# EAGLE design BSK (EAGLE 9.4.2)
ESKD_DESCRIPTION1: 207|235|224|242|224|32|193|209|202|49; ESKD_DESCRIPTION2: 241|245|229|236|224|32|253|235|229|234|242|240|232|247|229|241|234|224|255; ESKD_DESCRIPTION3: 239|240|232|237|246|232|239|232|224|235|252|237|224|255; ESKD_NUMBER: 67|67|83|49|46|50|50|48|48|45|48|221|51; ESKD_NUMBER_SHEET: 49; ESKD_SHEETS: 49
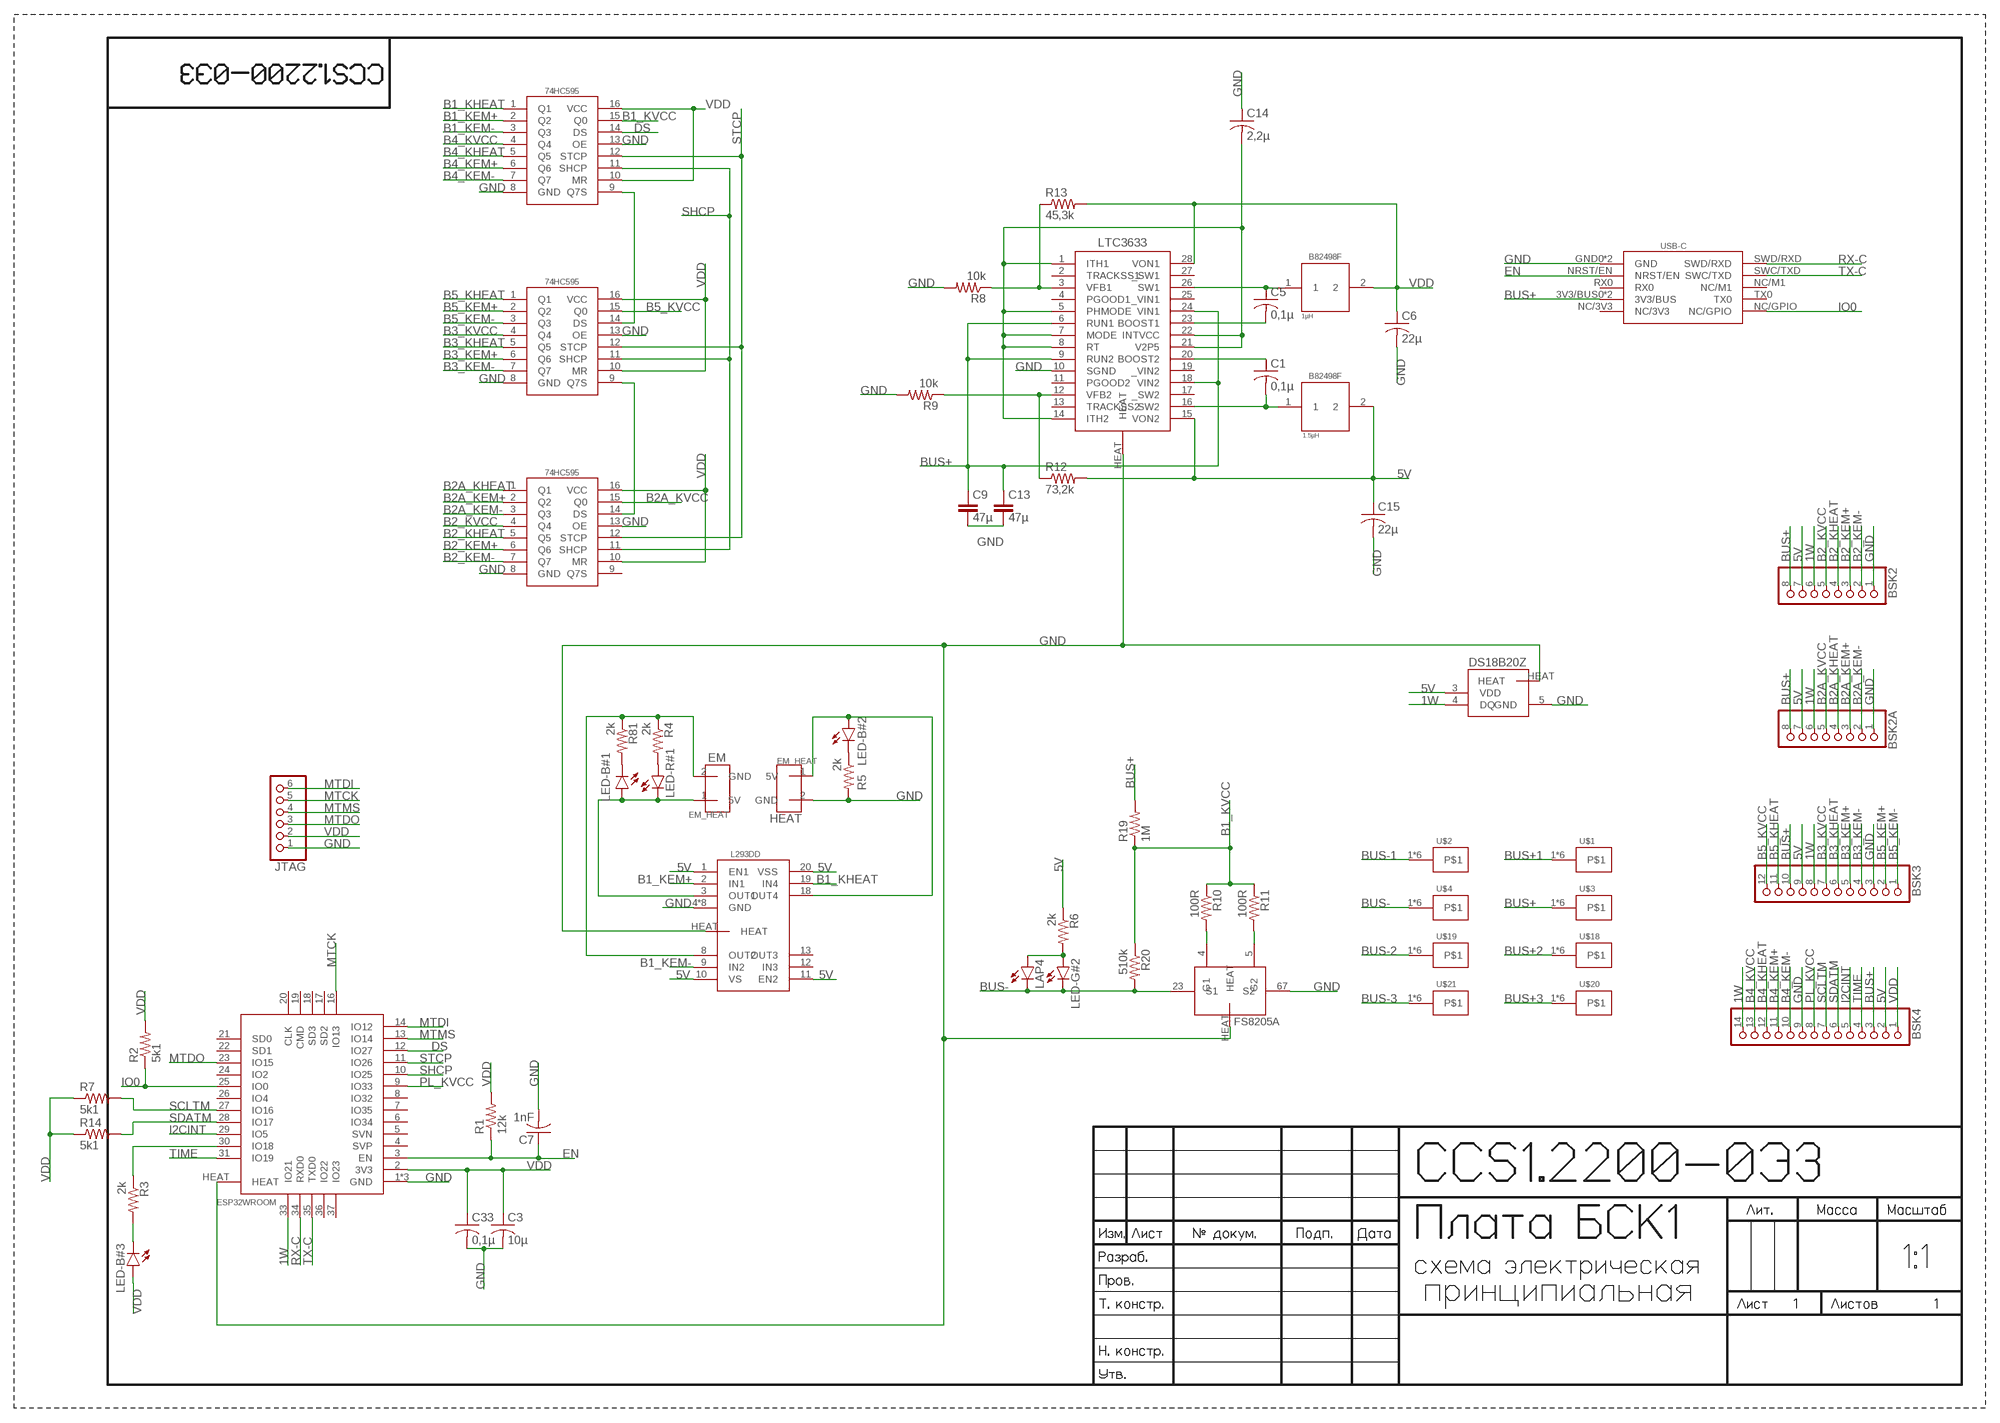
[diagram p0: schematic, sheet 1]

## Parts
74HC595#1  74HC595  [74HC595]
74HC595#2  74HC595  [74HC595]
74HC595#3  74HC595  [74HC595]
B82498F#1  1µH  B82498F  [B82498F]
B82498F#2  B82498F  [B82498F]
BSK2  PINHD-1X8  [1X08]
BSK2A  PINHD-1X8  [1X08]
BSK3  PINHD-1X12  [1X12]
BSK4  PINHD-1X14  [1X14]
C1  0,1µ  C-USC0603  [C0603]
C3  10µ  C-USC1206  [C1206]
C5  0,1µ  C-USC0603  [C0603]
C6  22µ  C-USC1206  [C1206]
C7  1nF  C-USC0603  [C0603]
C9  47µ  C-EUC1210  [C1210]
C13  47µ  C-EUC1210  [C1210]
C14  2,2µ  C-USC0603  [C0603]
C15  22µ  C-USC1206  [C1206]
C33  0,1µ  C-USC0603  [C0603]
DS18B20Z  DS18B20Z  [DS18B20Z]
EM  EM_HEAT  [EM_HEAT]
FS8205A  FS8205A+  [FS8205A+]
HEATER  EM_HEAT  [EM_HEAT]
JTAG  PINHD-1X6  [1X06]
L293DD  L293DD  [L293DD]
LAP4  LAP4-BOTTOM  [P47F-BOTTOM]
LED-B#1  LEDCHIPLED_0603  [CHIPLED_0603]
LED-B#2  LEDCHIPLED_0603  [CHIPLED_0603]
LED-B#3  LEDCHIPLED_0603  [CHIPLED_0603]
LED-G#2  LEDCHIPLED_0603  [CHIPLED_0603]
LED-R#1  LEDCHIPLED_0603  [CHIPLED_0603]
LTC3633  LTC3633  [LTC3633]
R1  12k  R-US_R0603  [R0603]
R2  5k1  R-US_R0603  [R0603]
R3  2k  R-US_R0603  [R0603]
R4  2k  R-US_R0603  [R0603]
R5  2k  R-US_R0603  [R0603]
R6  2k  R-US_R0603  [R0603]
R7  5k1  R-US_R0603  [R0603]
R8  10k  R-US_R0603  [R0603]
R9  10k  R-US_R0603  [R0603]
R10  100R  R-US_R0603  [R0603]
R11  100R  R-US_R0603  [R0603]
R12  73,2k  R-US_R0603  [R0603]
R13  45,3k  R-US_R0603  [R0603]
R14  5k1  R-US_R0603  [R0603]
R19  1M  R-US_R0603  [R0603]
R20  510k  R-US_R0603  [R0603]
R81  2k  R-US_R0603  [R0603]
U$1  KCONNECT  [KCONNECT]
U$2  KCONNECT  [KCONNECT]
U$3  KCONNECT  [KCONNECT]
U$4  KCONNECT  [KCONNECT]
U$13  ESP32WROOM  [ESP32WROOM]
U$18  KCONNECT  [KCONNECT]
U$19  KCONNECT  [KCONNECT]
U$20  KCONNECT  [KCONNECT]
U$21  KCONNECT  [KCONNECT]
USB-C  USB-C  [USB-C]

## Nets
1W: BSK2.6 BSK2A.6 BSK3.8 BSK4.14 DS18B20Z.4(DQ) U$13.33(IO21)
5V: B82498F#2.2 BSK2.7 BSK2A.7 BSK3.9 BSK4.2 C15.1 DS18B20Z.3(VDD) L293DD.1(EN1) L293DD.10(VS) L293DD.11(EN2) L293DD.20(VSS) LTC3633.15(VON2) R6.1 R12.2
B1_KEM+: 74HC595#1.2(Q2) L293DD.2(IN1)
B1_KEM-: 74HC595#1.3(Q3) L293DD.9(IN2)
B1_KHEAT: 74HC595#1.1(Q1) L293DD.19(IN4)
B1_KVCC: 74HC595#1.15(Q0) R10.1 R11.1 R19.1 R20.1
B2_KEM+: 74HC595#3.6(Q6) BSK2.3
B2_KEM-: 74HC595#3.7(Q7) BSK2.2
B2_KHEAT: 74HC595#3.5(Q5) BSK2.4
B2_KVCC: 74HC595#3.4(Q4) BSK2.5
B2A_KEM+: 74HC595#3.2(Q2) BSK2A.3
B2A_KEM-: 74HC595#3.3(Q3) BSK2A.2
B2A_KHEAT: 74HC595#3.1(Q1) BSK2A.4
B2A_KVCC: 74HC595#3.15(Q0) BSK2A.5
B3_KEM+: 74HC595#2.6(Q6) BSK3.5
B3_KEM-: 74HC595#2.7(Q7) BSK3.4
B3_KHEAT: 74HC595#2.5(Q5) BSK3.6
B3_KVCC: 74HC595#2.4(Q4) BSK3.7
B4_KEM+: 74HC595#1.6(Q6) BSK4.11
B4_KEM-: 74HC595#1.7(Q7) BSK4.10
B4_KHEAT: 74HC595#1.5(Q5) BSK4.12
B4_KVCC: 74HC595#1.4(Q4) BSK4.13
B5_KEM+: 74HC595#2.2(Q2) BSK3.2
B5_KEM-: 74HC595#2.3(Q3) BSK3.1
B5_KHEAT: 74HC595#2.1(Q1) BSK3.11
B5_KVCC: 74HC595#2.15(Q0) BSK3.12
BUS+: BSK2.8 BSK2A.8 BSK3.10 BSK4.3 C9.1 C13.1 LTC3633.6(RUN1) LTC3633.9(RUN2) LTC3633.18(VIN2) LTC3633.24(VIN1) R19.2 U$3.1 U$3.2 U$3.3 U$3.4 U$3.P$1 U$3.P$2 USB-C.3V3/BUS0(3V3/BUS) USB-C.3V3/BUS1(3V3/BUS)
BUS+1: U$1.1 U$1.2 U$1.3 U$1.4 U$1.P$1 U$1.P$2
BUS+2: U$18.1 U$18.2 U$18.3 U$18.4 U$18.P$1 U$18.P$2
BUS+3: U$20.1 U$20.2 U$20.3 U$20.4 U$20.P$1 U$20.P$2
BUS-: FS8205A.23(S1) LAP4.C LED-G#2.C R20.2 U$4.1 U$4.2 U$4.3 U$4.4 U$4.P$1 U$4.P$2
BUS-1: U$2.1 U$2.2 U$2.3 U$2.4 U$2.P$1 U$2.P$2
BUS-2: U$19.1 U$19.2 U$19.3 U$19.4 U$19.P$1 U$19.P$2
BUS-3: U$21.1 U$21.2 U$21.3 U$21.4 U$21.P$1 U$21.P$2
DS: 74HC595#1.14(DS) U$13.12(IO27)
EN: C7.1 R1.1 U$13.3(EN) USB-C.NRST/EN
GND: 74HC595#1.8(GND) 74HC595#1.13(OE) 74HC595#2.8(GND) 74HC595#2.13(OE) 74HC595#3.8(GND) 74HC595#3.13(OE) BSK2.1 BSK2A.1 BSK3.3 BSK4.9 C3.2 C6.2 C7.2 C9.2 C13.2 C14.1 C15.2 C33.2 DS18B20Z.5(GND) DS18B20Z.HEAT FS8205A.67(S2) FS8205A.HEAT HEATER.2(GND) JTAG.1 L293DD.4(GND) L293DD.5(GND) L293DD.6(GND) L293DD.7(GND) L293DD.14(GND) L293DD.15(GND) L293DD.16(GND) L293DD.17(GND) L293DD.HEAT LTC3633.10(SGND) LTC3633.HEAT R5.2 R8.2 R9.2 U$13.1(GND) U$13.15(GND) U$13.38(GND) U$13.HEAT USB-C.GND0(GND) USB-C.GND1(GND)
I2CINT: BSK4.5 U$13.29(IO5)
IO0: R2.1 U$13.25(IO0) USB-C.NC/GPIO
IO1: R3.1 U$13.30(IO18)
MTCK: JTAG.5 U$13.16(IO13)
MTDI: JTAG.6 U$13.14(IO12)
MTDO: JTAG.3 U$13.23(IO15)
MTMS: JTAG.4 U$13.13(IO14)
N$1: EM.1(5V) L293DD.3(OUT1) LED-B#1.A LED-R#1.C
N$2: EM.2(GND) L293DD.8(OUT2) R4.1 R81.1
N$3: HEATER.1(5V) L293DD.18(OUT4) LED-B#2.A
N$8: FS8205A.4(G1) R10.2
N$9: FS8205A.5(G2) R11.2
N$19: 74HC595#1.9(Q7S) 74HC595#2.14(DS)
N$20: 74HC595#2.9(Q7S) 74HC595#3.14(DS)
N$24: C14.2 LTC3633.1(ITH1) LTC3633.5(PHMODE) LTC3633.7(MODE) LTC3633.8(RT) LTC3633.14(ITH2) LTC3633.21(V2P5) LTC3633.22(INTVCC)
N$25: LTC3633.3(VFB1) R8.1 R13.1
N$28: B82498F#1.1 C5.1 LTC3633.26(SW1)
N$31: C5.2 LTC3633.23(BOOST1)
N$32: C1.1 LTC3633.20(BOOST2)
N$33: B82498F#2.1 C1.2 LTC3633.16(SW2)
N$34: LED-B#3.C R3.2
N$35: LED-B#1.C R81.2
N$36: LED-R#1.A R4.2
N$37: LED-B#2.C R5.1
N$38: LAP4.A LED-G#2.A R6.2
N$39: LTC3633.12(VFB2) R9.1 R12.1
PL_KVCC: BSK4.8 U$13.9(IO33)
RX-C: U$13.34(RXD0) USB-C.SWD/RXD
SCLTM: BSK4.7 R7.2 U$13.27(IO16)
SDATM: BSK4.6 R14.2 U$13.28(IO17)
SHCP: 74HC595#1.11(SHCP) 74HC595#2.11(SHCP) 74HC595#3.11(SHCP) U$13.10(IO25)
STCP: 74HC595#1.12(STCP) 74HC595#2.12(STCP) 74HC595#3.12(STCP) U$13.11(IO26)
TIME: BSK4.4 U$13.31(IO19)
TX-C: U$13.35(TXD0) USB-C.SWC/TXD
VDD: 74HC595#1.10(MR) 74HC595#1.16(VCC) 74HC595#2.10(MR) 74HC595#2.16(VCC) 74HC595#3.10(MR) 74HC595#3.16(VCC) B82498F#1.2 BSK4.1 C3.1 C6.1 C33.1 JTAG.2 LED-B#3.A LTC3633.28(VON1) R1.2 R2.2 R7.1 R13.2 R14.1 U$13.2(3V3)
Unconnected: 74HC595#3.9(Q7S) L293DD.12(IN3) L293DD.13(OUT3) LTC3633.2(TRACKSS1) LTC3633.4(PGOOD1) LTC3633.11(PGOOD2) LTC3633.13(TRACKSS2) LTC3633.17(_SW2) LTC3633.19(_VIN2) LTC3633.25(_VIN1) LTC3633.27(_SW1) U$13.4(SVP) U$13.5(SVN) U$13.6(IO34) U$13.7(IO35) U$13.8(IO32) U$13.17(SD2) U$13.18(SD3) U$13.19(CMD) U$13.20(CLK) U$13.21(SD0) U$13.22(SD1) U$13.24(IO2) U$13.26(IO4) U$13.36(IO22) U$13.37(IO23) USB-C.NC/3V3 USB-C.NC/M1 USB-C.RX0 USB-C.TX0

## Notes on the sheet
- 1µH
- 1.5µH
- EM
- HEAT

## Library data of the parts
74HC595#1-74HC595#3 = CanCubeSat:74HC595
B82498F#1 B82498F#2 = CanCubeSat:B82498F
BSK2 BSK2A = pinheadCS:PINHD-1X8: PIN HEADER
BSK3 = pinheadCS:PINHD-1X12: PIN HEADER
BSK4 = pinheadCS:PINHD-1X14: PIN HEADER
C1 C3 C5-C7 C14 C15 C33 = rcl:C-US: CAPACITOR, American symbol; SPICEPREFIX: C
C9 C13 = rcl:C-EU: CAPACITOR, European symbol; SPICEPREFIX: C
DS18B20Z = CanCubeSat:DS18B20Z
EM HEATER = CanCubeSat:EM_HEAT
FS8205A = CanCubeSat:FS8205A+
JTAG = pinheadCS:PINHD-1X6: PIN HEADER
L293DD = CanCubeSat:L293DD
LAP4 = led:*P4: PointLED® Enhanced Thinfilm LED TOP & BOTTOM mount LS P47F, LR P47F, LA P47F, LY P47F, LT P4SG, LB P4SG, LW P4SG Source: http://catalog.osram-os.com .. LA_LR_LS_LY_P47F_Pb_free.pdf
LED-B#1-LED-B#3 LED-G#2 LED-R#1 = led:LED: LED OSRAM: - CHIPLED LG R971, LG N971, LY N971, LG Q971, LY Q971, LO R971, LY R971 LH N974, LH R974 LS Q976, LO Q976, LY Q976 LO Q996 - Hyper CHIPLED LW Q18S LB Q993, LB Q99A, LB R99A - SideLED LS A670, LO A670, LY A670, LG A670, LP A670 LB A673, LV A673, LT A673, LW A673 LH A674 LY A675 LS A676, LA A676, LO A676, LY A676, LW A676 LS A679, LY A679, LG A679 - Hyper Micro SIDELED® LS Y876, LA Y876, LO Y876, LY Y876 LT Y87S - SmartLED LW L88C, LW L88S LB L89C, LB L89S, LG L890 LS L89K, LO L89K, LY L89K LS L896, LA L896, LO L896, LY L896 - TOPLED LS T670, LO T670, LY T670, LG T670, LP T670 LSG T670, LSP T670, LSY T670, LOP T670, LYG T670 LG T671, LOG T671, LSG T671 LB T673, LV T673, LT T673, LW T673 LH T674 LS T676, LA T676, LO T676, LY T676, LB T676, LH T676, LSB T676, LW T676 LB T67C, LV T67C, LT T67C, LS T67K, LO T67K, LY T67K, LW E67C LS E67B, LA E67B, LO E67B, LY E67B, LB E67C, LV E67C, LT E67C LW T67C LS T679, LY T679, LG T679 LS T770, LO T770, LY T770, LG T770, LP T770 LB T773, LV T773, LT T773, LW T773 LH T774 LS E675, LA E675, LY E675, LS T675 LS T776, LA T776, LO T776, LY T776, LB T776 LHGB T686 LT T68C, LB T68C - Hyper Mini TOPLED® LB M676 - Mini TOPLED Santana® LG M470 LS M47K, LO M47K, LY M47K Source: http://www.osram.convergy.de LUXEON: - LUMILED® LXK2-PW12-R00, LXK2-PW12-S00, LXK2-PW14-U00, LXK2-PW14-V00 LXK2-PM12-R00, LXK2-PM12-S00, LXK2-PM14-U00 LXK2-PE12-Q00, LXK2-PE12-R00, LXK2-PE12-S00, LXK2-PE14-T00, LXK2-PE14-U00 LXK2-PB12-K00, LXK2-PB12-L00, LXK2-PB12-M00, LXK2-PB14-N00, LXK2-PB14-P00, LXK2-PB14-Q00 LXK2-PR12-L00, LXK2-PR12-M00, LXK2-PR14-Q00, LXK2-PR14-R00 LXK2-PD12-Q00, LXK2-PD12-R00, LXK2-PD12-S00 LXK2-PH12-R00, LXK2-PH12-S00 LXK2-PL12-P00, LXK2-PL12-Q00, LXK2-PL12-R00 Source: www.luxeon.com KINGBRIGHT: KA-3528ASYC Source: www.kingbright.com
LTC3633 = CanCubeSat:LTC3633
R1-R14 R19 R20 R81 = resistor:R-US_: RESISTOR, American symbol
U$1-U$4 U$18-U$21 = CanCubeSat:KCONNECT
U$13 = CanCubeSat:ESP32WROOM
USB-C = CanCubeSat:USB-C; SPICEPREFIX: X

## Board
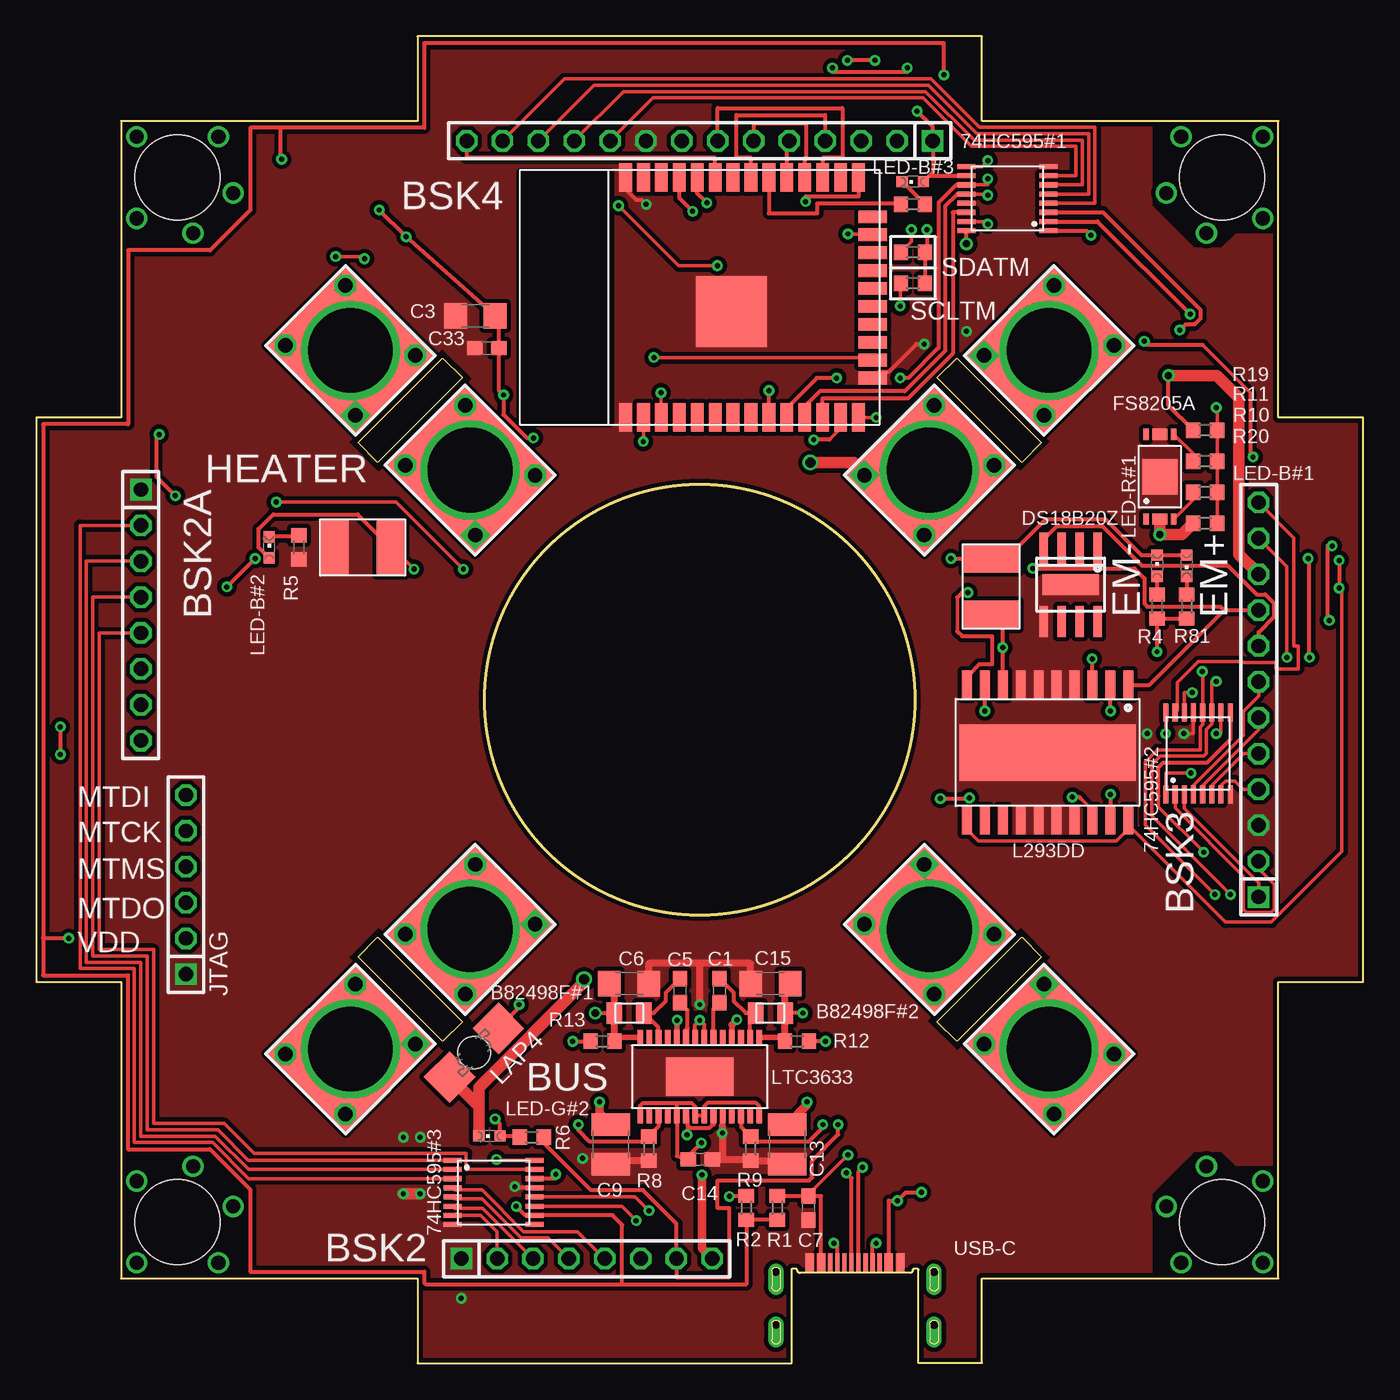
[diagram p1: board, top side]
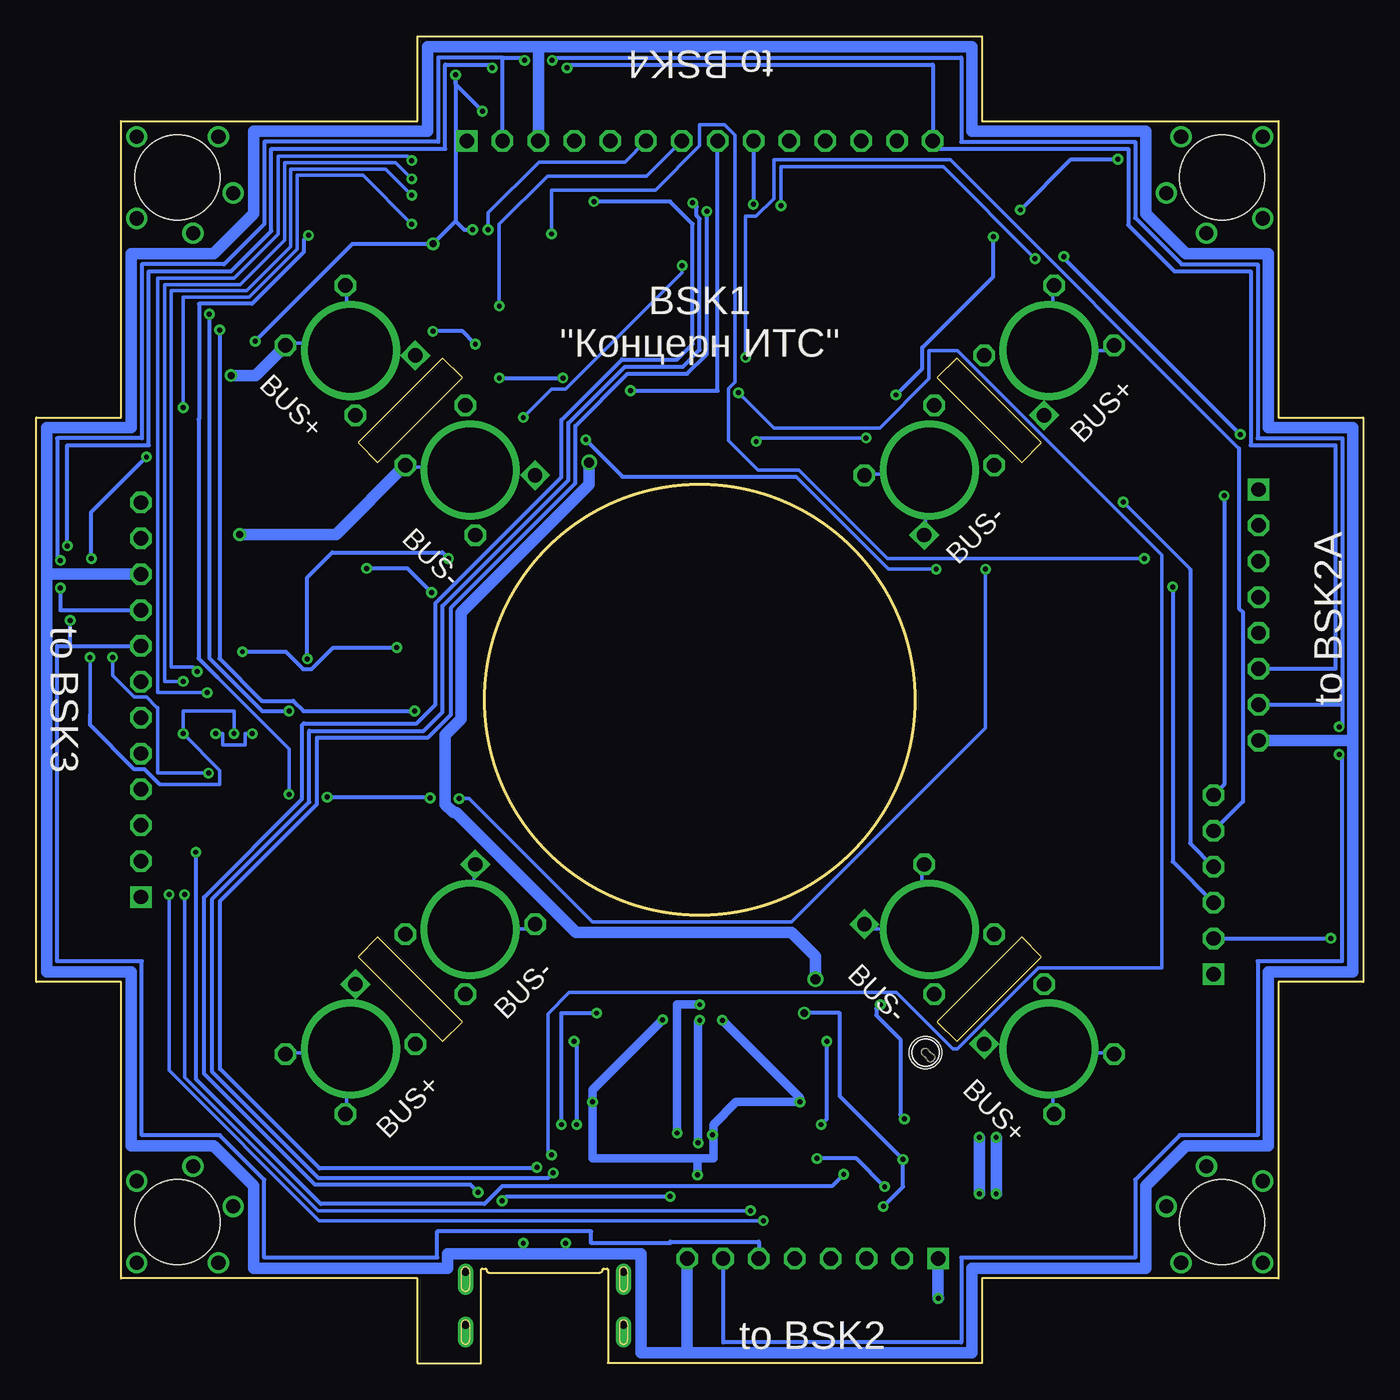
[diagram p2: board, bottom side, seen from below]

Size 94 x 94 mm. Coordinates in mm from the lower left corner, seen from the top.
Outline: 53.5,0 27,0 27,6 6,6 6,27 0,27 0,67 6,67 6,88 27,88 27,94 67,94 67,88 88,88 88,67 94,67 94,27 88,27 88,6 67,6 67,0 62.5,0
Outline: 63.79,24.2 69.8,30.21 71.22,28.79 65.21,22.78 63.79,24.2
Outline: 22.78,65.21 28.79,71.22 30.21,69.8 24.2,63.79 22.78,65.21
Outline: 69.8,63.79 63.79,69.8 65.21,71.22 71.22,65.21 69.8,63.79
Outline: 28.79,22.78 22.78,28.79 24.2,30.21 30.21,24.2 28.79,22.78
Outline: circle at 47,47 radius 15.25
Copper layers (1*16): Top 0.035mm / dielectric 1.5mm / Bottom 0.035mm
Design rules "default *": minimum track width 0.25mm, minimum drill 0.35mm, track to track 0.2mm, track to pad 0.2mm, pad to pad 0.2mm, via to via 0.2mm, smd to smd 0.2mm, copper to edge 0.25mm, drill to drill 6mil, minimum pad ring 10mil, minimum via ring 8mil, stop-mask expansion 2mil, vias tented up to drill 0mil, thermal gap 10mil
Holes 6 mm at 10,10 84,84 10,84 84,10

### Footprints (pad centres in the part's own frame; a part is rotated, then mirrored left to right if it is on the bottom)
74HC595 = smd 1.26 x 0.36: 1 -2.9,2.275; 2 -2.9,1.625; 3 -2.9,0.975; 4 -2.9,0.325; 5 -2.9,-0.325; 6 -2.9,-0.975; 7 -2.9,-1.625; 8 -2.9,-2.275; 9 2.9,-2.275; 10 2.9,-1.625; 11 2.9,-0.975; 12 2.9,-0.325; 13 2.9,0.325; 14 2.9,0.975; 15 2.9,1.625; 16 2.9,2.275
B82498F = smd 1.1 x 1.5: 1 -1.05,0; 2 1.05,0
1X08 = drill 1.016 square: 1 -8.89,0 | drill 1.016 octagon: 2 -6.35,0; 3 -3.81,0; 4 -1.27,0; 5 1.27,0; 6 3.81,0; 7 6.35,0; 8 8.89,0
1X12 = drill 1.016 square: 1 -13.97,0 | drill 1.016 octagon: 2 -11.43,0; 3 -8.89,0; 4 -6.35,0; 5 -3.81,0; 6 -1.27,0; 7 1.27,0; 8 3.81,0; 9 6.35,0; 10 8.89,0; 11 11.43,0; 12 13.97,0
1X14 = drill 1.016 square: 1 -16.51,0 | drill 1.016 octagon: 2 -13.97,0; 3 -11.43,0; 4 -8.89,0; 5 -6.35,0; 6 -3.81,0; 7 -1.27,0; 8 1.27,0; 9 3.81,0; 10 6.35,0; 11 8.89,0; 12 11.43,0; 13 13.97,0; 14 16.51,0
C0603 = smd 1.1 x 1: 1 -0.85,0; 2 0.85,0
C1206 = smd 1.6 x 1.8: 1 -1.4,0; 2 1.4,0
C1210 = smd 1.6 x 2.7: 1 -1.4,0; 2 1.4,0
DS18B20Z = smd 0.6 x 2.2: 1 -1.905,-2.6; 2 -0.635,-2.6; 3 0.635,-2.6; 4 1.905,-2.6; 5 1.905,2.6; 6 0.635,2.6; 7 -0.635,2.6; 8 -1.905,2.6 | smd 4 x 1.5: HEAT 0,0
EM_HEAT = smd 2 x 4: 1 -2,0; 2 2,0
FS8205A+ = smd 0.4 x 0.8: 1 -0.975,-3; 4 0.975,-3; 5 0.975,3; 8 -0.975,3 | smd 1.05 x 0.8: 23 0,-3; 67 0,3 | smd 2.5 x 2.5: HEAT 0,0
1X06 = drill 1.016 square: 1 -6.35,0 | drill 1.016 octagon: 2 -3.81,0; 3 -1.27,0; 4 1.27,0; 5 3.81,0; 6 6.35,0
L293DD = smd 0.7 x 2: 1 -5.715,-4.8; 2 -4.445,-4.8; 3 -3.175,-4.8; 4 -1.905,-4.8; 5 -0.635,-4.8; 6 0.635,-4.8; 7 1.905,-4.8; 8 3.175,-4.8; 9 4.445,-4.8; 10 5.715,-4.8; 11 5.715,4.8; 12 4.445,4.8; 13 3.175,4.8; 14 1.905,4.8; 15 0.635,4.8; 16 -0.635,4.8; 17 -1.905,4.8; 18 -3.175,4.8; 19 -4.445,4.8; 20 -5.715,4.8 | smd 12.5 x 4: HEAT 0,0
P47F-BOTTOM = smd 2.6 x 2.6: A -2.45,0; C 2.45,0 | hole 2.3: 0,0
CHIPLED_0603 = smd 0.8 x 0.8: A 0,-0.75; C 0,0.75
LTC3633 = smd 0.4 x 1.05: 1 -4.225,-2.775; 2 -3.575,-2.775; 3 -2.925,-2.775; 4 -2.275,-2.775; 5 -1.625,-2.775; 6 -0.975,-2.775; 7 -0.325,-2.775; 8 0.325,-2.775; 9 0.975,-2.775; 10 1.625,-2.775; 11 2.275,-2.775; 12 2.925,-2.775; 13 3.575,-2.775; 14 4.225,-2.775; 15 4.225,2.775; 16 3.575,2.775; 17 2.925,2.775; 18 2.275,2.775; 19 1.625,2.775; 20 0.975,2.775; 21 0.325,2.775; 22 -0.325,2.775; 23 -0.975,2.775; 24 -1.625,2.775; 25 -2.275,2.775; 26 -2.925,2.775; 27 -3.575,2.775; 28 -4.225,2.775 | smd 4.75 x 2.74: HEAT 0,0
R0603 = smd 1 x 1.1: 1 -0.85,0; 2 0.85,0
KCONNECT = drill 1.016 square: 1 -3,-3.5 | drill 1.016 octagon: 2 -3,3.5; 3 3,-3.5; 4 3,3.5 | drill 6: P$1 0,0 | smd 8 x 9: P$2 0,0
ESP32WROOM = smd 2 x 0.9: 1 -8.5,5.26; 2 -8.5,3.99; 3 -8.5,2.72; 4 -8.5,1.45; 5 -8.5,0.18; 6 -8.5,-1.09; 7 -8.5,-2.36; 8 -8.5,-3.63; 9 -8.5,-4.9; 10 -8.5,-6.17; 11 -8.5,-7.44; 12 -8.5,-8.71; 13 -8.5,-9.98; 14 -8.5,-11.25; 25 8.5,-11.25; 26 8.5,-9.98; 27 8.5,-8.71; 28 8.5,-7.44; 29 8.5,-6.17; 30 8.5,-4.9; 31 8.5,-3.63; 32 8.5,-2.36; 33 8.5,-1.09; 34 8.5,0.18; 35 8.5,1.45; 36 8.5,2.72; 37 8.5,3.99; 38 8.5,5.26 | smd 0.9 x 2: 15 -5.715,-12.25; 16 -4.445,-12.25; 17 -3.175,-12.25; 18 -1.905,-12.25; 19 -0.635,-12.25; 20 0.635,-12.25; 21 1.905,-12.25; 22 3.175,-12.25; 23 4.445,-12.25; 24 5.715,-12.25 | smd 5.01 x 5.01: HEAT -1.01,-2.24
USB-C = smd 0.3 x 1.4: 3V3/BUS0 -1.25,7.1; 3V3/BUS1 1.25,7.1; NC/3V3 -0.75,7.1; NC/M1 0.75,7.1; RX0 -1.75,7.1; SWC/TXD 0.25,7.1; SWD/RXD -0.25,7.1; TX0 1.75,7.1 | smd 0.6 x 1.4: GND0 -3.2,7.1; GND1 3.2,7.1; NC/GPIO 2.4,7.1; NRST/EN -2.4,7.1 | drill 0.6 pad 1.1 offset: P$13 -5.6,6.5; P$14 -5.6,2.75; P$15 5.6,6.5; P$16 5.6,2.75

### Placement (x,y rotation side)
74HC595#1  68.8,82.5 180 top
74HC595#2  82.3,43.2 90 top
74HC595#3  32.4,12.1 0 top
B82498F#1  42,24.8 180 top
B82498F#2  52,24.8 0 top
BSK2  39,7.4 0 top
BSK2A  7.4,53 270 top
BSK3  86.6,47 90 top
BSK4  47,86.6 180 top
C1  48.4,26.4 90 top
C3  31.1,74.2 180 top
C5  45.6,26.4 270 top
C6  42,26.9 0 top
C7  54.7,11 270 top
C9  40.7,15.5 270 top
C13  53.2,15.5 270 top
C14  47.03,14.44 180 top
C15  52,26.9 180 top
C33  31.9,71.9 180 top
DS18B20Z  73.27,55.16 180 top
EM  67.63,55.02 270 top
FS8205A  79.6,62.8 0 top
HEATER  23.11,57.78 180 top
JTAG  10.6,33.9 90 top
L293DD  71.64,43.26 180 top
LAP4  31,22 225 top
LED-B#1  81.49,56.5 180 top
LED-B#2  16.5,57.8 0 top
LED-B#3  62.1,83.7 90 top
LED-G#2  32.1,16.1 90 top
LED-R#1  79.4,56.5 0 top
LTC3633  47,20.3 0 top
R1  52.5,11 270 top
R2  50.3,11 270 top
R3  62.1,82.1 0 top
R4  79.4,53.6 90 top
R5  18.6,57.8 270 top
R6  35.1,16 180 top
R7  62.1,76.5 180 top
R8  43.4,15.2 270 top
R9  50.6,15.2 270 top
R10  82.8,61.7 180 top
R11  82.8,63.9 180 top
R12  53.9,22.8 180 top
R13  40.1,22.8 0 top
R14  62.1,78.7 180 top
R19  82.8,66.1 180 top
R20  82.8,59.5 180 top
R81  81.5,53.6 90 top
U$1  22.25,71.75 45 top
U$2  30.74,63.26 45 top
U$3  71.75,71.75 315 top
U$4  63.26,63.26 315 top
U$13  47,75.5 90 top
U$18  22.25,22.25 135 top
U$19  30.74,30.74 135 top
U$20  71.75,22.25 225 top
U$21  63.26,30.74 225 top
USB-C  58,0 0 top

### Tracks (layer width: path | path; a pad name or v marks a point on that pad's centre or on a via)
1W  (via drill 0.35)
  Top 0.3: U$13.33 48.09,85.39 48.1,85.4 30.49,85.4 BSK4.14 | v91.8,57.9 91.47,57.9 91.47,52.62 v91.6,52.62 | v61.7,91.77 61.7,91.47 56.4,91.47 v56.4,91.77 | BSK3.8 86.6,51.78 87.71,52.89 87.71,53.81 87.06,54.46 86.45,54.46 84.42,56.5 78.33,56.5 75.53,59.3 72.29,59.3 71.37,58.38 DS18B20Z.4
  Bottom 0.3: 91.6,50.81 92.52,50.81 92.52,28.48 86.52,28.48 86.52,16.15 81,16.15 77.85,13 77.85,7.48 65.61,7.48 65.61,9.33 54.7,9.33 54.7,8.51 49.1,8.51 49.1,8.61 42.81,8.61 BSK2.6 | 91.6,50.81 BSK3.8 | 91.6,50.81 v91.6,52.62 | v91.8,57.9 91.8,65.02 86.02,65.02 86.02,77.35 80.2,77.35 77.35,80.2 77.35,86.02 65.02,86.02 65.02,92 61.7,92 v61.7,91.77 | v56.4,91.77 56.4,92 30.49,92 BSK4.14 30.49,86.02 16.65,86.02 16.65,80.64 13.36,77.35 7.98,77.35 7.98,65.02 1.98,65.02 1.98,49.19 BSK2A.6
5V  (via drill 0.35)
  Top 0.25: 77.25,37.75 76.5,37 66.75,37 66,37.75 66,38.25 L293DD.11 | 77.25,37.75 77.25,38.25 L293DD.20 77.25,37.75 | 65.25,51.85 65.25,54.25 | 77.25,37.75 77.75,37.75 84.25,31.25 87.5,31.25 92.5,36.25 92.5,54.75 v92.3,54.92
  Top 0.3: v59.41,92.3 v57.45,92.3 | v1.7,45.08 | v1.7,45.08 v1.7,43.12 | v92.3,56.88 v92.3,54.92 | L293DD.1 78.86,48.06 84.14,53.35 | 84.14,53.35 BSK3.9 | DS18B20Z.3 72.64,56.3 v70.61,56.3 72.56,56.3 72.57,56.31 77.79,56.31 78.5,55.6 78.5,53.8 78.7,53.6 83.89,53.6 84.14,53.35 | R6.1 35.95,15.6 39.3,12.25 42.98,12.25 45.35,9.88 BSK2.7 45.35,6.1 49.1,6.1 49.1,10.98 48.27,10.98 48.27,12.95 54.74,12.95 54.95,13.15 54.95,14.35 56.8,16.2 v56.8,16.9 | v54.3,24.8 B82498F#2.2 | 65.25,51.85 65.6,51.5 67.7,51.5 67.7,49.5 66.79,49.5 66.09,48.8 66.09,48.23 L293DD.10 | 65.25,54.25 65.6,54.6 v66,54.6
  Top 0.4: LTC3633.15 53.25,23.07
  Top 0.5: 53.25,23.07 R12.2 B82498F#2.2 53.05,26.55 C15.1
  Bottom 0.3: BSK4.2 60.97,92.5 | 60.97,92.5 59.41,92.5 v59.41,92.3 | v57.45,92.3 57.45,92.5 28.48,92.5 28.48,86.52 16.15,86.52 16.15,81.14 12.86,77.85 7.48,77.85 7.48,65.52 1.48,65.52 1.48,46.65 | v1.7,45.08 1.48,45.08 1.48,46.65 | v1.7,43.12 1.5,43.12 1.5,28.48 7.48,28.48 7.48,16.15 13,16.15 16.15,13 16.15,7.48 28.48,7.48 28.48,1.48 45.35,1.48 BSK2.7 | BSK2A.7 1.48,46.65 | 60.97,92.5 65.52,92.5 65.52,86.52 77.85,86.52 77.85,80.7 80.7,77.85 86.52,77.85 86.52,65.52 92.52,65.52 92.52,56.88 v92.3,56.88 | v92.3,54.92 92.3,53.35 BSK3.9 | v56.8,16.9 56.8,24.8 v54.3,24.8 | v66,54.6 67.71,56.3 v70.61,56.3
B1_KEM+  (via drill 0.35)
  Top 0.3: 74HC595#1.2 75.19,80.88 v81.74,74.32 | v76.1,46.2 76.08,46.22 L293DD.2
  Bottom 0.3: v81.74,74.32 81.74,49.94 78,46.2 v76.1,46.2
B1_KEM-  (via drill 0.35)
  Top 0.3: 74HC595#1.3 75.58,81.53 82.47,74.63 82.47,74.02 82.04,73.59 81.41,73.59 v81.01,73.2 | v67.2,46.2 v67.19,46.2 L293DD.9
  Bottom 0.3: v81.01,73.2 81.01,49.92 78.02,46.93 75.8,46.93 75.07,46.2 v67.2,46.2
B1_KHEAT  (via drill 0.35)
  Top 0.3: 74HC595#1.1 74.39,80.22 v74.72,79.9 | v76.1,40.3 76.1,38.48 L293DD.19
  Bottom 0.25: 81.17,48.6 76.1,43.53 v76.1,40.3
  Bottom 0.3: v74.72,79.9 75.05,79.57 75.05,78.72 78.72,75.05 82.47,75.05 82.47,66.87 82.5,66.87 82.5,49.93 81.17,48.6
B1_KVCC  (via drill 0.35)
  Top 0.25: R20.1 R10.1 R11.1 R19.1 83.65,67.65 v83.6,67.7 | v67.4,80.7 67.22,80.88 74HC595#1.15
  Bottom 0.25: v83.6,67.7 83.6,75.52 78.92,75.52 75.52,78.92 75.52,84.15 70.85,84.15 v67.4,80.7
B2_KEM+
  Top 0.25: 74HC595#3.6 29.64,10.98 31.6,10.98 34.16,8.42 34.17,8.42 BSK2.3
B2_KEM-
  Top 0.25: 74HC595#3.7 31.47,10.47 32.65,9.3 BSK2.2
B2_KHEAT
  Top 0.25: 74HC595#3.5 29.64,11.63 31.59,11.63 34.35,8.87 36.26,8.87 BSK2.4
B2_KVCC
  Top 0.25: 74HC595#3.4 29.64,12.28 31.57,12.28 34.53,9.32 38.35,9.32 BSK2.5
B2A_KEM+
  Top 0.25: BSK2A.3 3.55,56.81 3.55,28.4 7.4,28.4 7.4,16.08 12.69,16.08 15.04,13.72 74HC595#3.2
B2A_KEM-
  Top 0.25: 74HC595#3.3 15.05,13.07 12.5,15.63 6.95,15.63 6.95,27.95 3.1,27.95 3.1,59.35 BSK2A.2
B2A_KHEAT
  Top 0.25: 74HC595#3.1 15.02,14.38 12.87,16.53 7.85,16.53 7.85,28.85 4,28.85 4,54.27 BSK2A.4
B2A_KVCC
  Top 0.25: 74HC595#3.15 30.45,13.72 30.45,14.88 15.42,14.88 13.32,16.98 8.3,16.98 8.3,29.3 4.45,29.3 4.45,51.73 BSK2A.5
B3_KEM+
  Top 0.25: BSK3.5 85.55,43.19 83.28,40.92 74HC595#2.6
B3_KEM-
  Top 0.25: BSK3.4 85.5,40.65 85.22,40.92 84.89,41.26 84.26,41.26 83.92,40.92 74HC595#2.7
B3_KHEAT
  Top 0.25: BSK3.6 86.6,44.9 82.62,40.92 74HC595#2.5
B3_KVCC
  Top 0.25: BSK3.7 86.6,47.27 85.51,46.18 85.51,44.46 81.97,40.92 74HC595#2.4
B4_KEM+
  Top 0.25: BSK4.11 41.6,90.09 63,90.09 66.44,86.65 74.1,86.65 74.1,83.47 74HC595#1.6
B4_KEM-
  Top 0.25: 74HC595#1.7 73.65,84.12 73.65,86.2 66.25,86.2 62.81,89.64 43.69,89.64 BSK4.10
B4_KHEAT
  Top 0.25: 74HC595#1.5 74.55,82.83 74.55,87.1 66.63,87.1 63.19,90.54 40,90.54 39.51,90.54 BSK4.12
B4_KVCC
  Top 0.25: BSK4.13 37.42,90.99 63.37,90.99 66.81,87.55 75,87.55 75,82.17 74HC595#1.4
B5_KEM+
  Top 0.25: BSK3.2 86.6,35.01 87.69,33.93 87.69,32.13 87.5,31.94 85.7,31.94 85.51,32.13 85.51,34.48 80.67,39.32 74HC595#2.2
B5_KEM-
  Top 0.25: BSK3.1 86.6,34.03 81.33,39.31 74HC595#2.3
B5_KHEAT  (via drill 0.35)
  Top 0.25: v88.6,50 88.6,56.43 BSK3.11 | v81.8,41.8 80.03,41.8 74HC595#2.1
  Bottom 0.25: v88.6,50 88.6,48.73 87.05,47.18 86.18,47.18 85.5,46.5 85.39,46.45 85.39,41.8 v81.8,41.8
B5_KVCC
  Top 0.25: 74HC595#2.15 80.82,46.24 80.82,48.21 82.31,49.7 85.41,49.7 85.41,49.62 87.8,49.62 87.8,49.2 89.41,49.2 89.41,50.8 89.1,50.8 89.1,58.47 BSK3.12
BUS+  (via drill 0.35, 0.5)
  Top 0.25: 71.5,71.5 67.25,71.5 U$3.1 | 71.5,71.5 71.5,67.25 U$3.3 | 71.5,71.5 U$3.P$1
  Top 0.3: LTC3633.9 47.98,16.89 47.91,16.89 47.67,16.65 46.33,16.65 46.12,16.86 | USB-C.3V3/BUS0 56.75,8.5 v56.5,8.5 | USB-C.3V3/BUS1 59.25,8.5 v59.5,8.5 | R19.2 80.21,67.84 v80.21,69.97 | 46.12,16.86 46.12,17.43 LTC3633.6 | 46.12,16.86 46.12,16.2 v46.1,16.18
  Top 0.4: LTC3633.24 45.38,24.27 | LTC3633.18 49.27,23.98
  Top 0.5: 45.38,24.27 v45.4,24.3 | 49.27,23.98 v49.63,24.33
  Top 0.6: v39.9,18.5 39.9,17.7 C9.1 | v54.6,18.5 54.6,18.3 C13.1 | BSK2.8 47.15,8.14 v47.15,13.33
  Top 0.8: BSK3.10 85.2,57.29 85.2,68.4 83.62,69.97 v80.21,69.97
  Bottom 0.25: 72,72.25 72,71.75 U$3.P$1 72,72.25 | 72,72.25 72,76.25 U$3.2 | 72,72.25 76,72.25 U$3.4
  Bottom 0.3: v56.5,8.5 56.5,7.76 | v59.5,8.5 59.5,7.76
  Bottom 0.6: v45.4,24.3 39.9,18.8 v39.9,18.5 44.43,18.5 46.03,16.9 46.03,16.25 v46.1,16.18 46.03,16.11 46.03,14.52 47.3,14.52 | v49.63,24.33 54.6,19.36 v54.6,18.5 54.6,14.52 47.3,14.52 | v47.15,13.33 47.15,14.37 47.3,14.52
  Bottom 0.8: BSK4.3 58.43,93.27 | 58.43,93.27 27.73,93.27 27.73,87.27 15.4,87.27 15.4,81.45 12.55,78.6 6.73,78.6 6.73,66.27 0.73,66.27 0.73,44.1 | 0.73,44.1 0.73,27.73 6.73,27.73 6.73,15.4 12.55,15.4 15.4,12.55 15.4,6.73 27.73,6.73 27.73,0.73 47.9,0.73 | 47.9,0.73 51.14,0.73 51.14,7.76 56.5,7.76 59.5,7.76 64.86,7.76 64.86,6.73 78.6,6.73 78.6,12.55 81.45,15.4 87.27,15.4 87.27,27.73 93.27,27.73 93.27,55.9 | 93.27,55.9 93.27,66.27 87.27,66.27 87.27,78.6 81.45,78.6 78.6,81.45 78.6,87.27 66.27,87.27 66.27,93.27 58.43,93.27 | BSK3.10 93.27,55.9 | BSK2.8 47.9,0.73 | BSK2A.8 0.73,44.1 | v80.21,69.97 78.47,69.97 U$3.4
BUS+1
  Top 0.25: 22.5,71.5 22.5,67.25 U$1.1 | 22.5,71.5 26.75,71.5 U$1.3 | 22.5,71.5 U$1.P$1
  Bottom 0.25: 22,71.75 U$1.P$1 22,71.75 | 22,71.75 18,71.75 17.75,72 U$1.2 | 22,71.75 22,76.25 U$1.4
BUS+2
  Top 0.25: 22.5,22.75 22.5,22.5 U$18.P$1 22.5,22.75 | 22.5,22.75 22.5,26.75 U$18.3 | 22.5,22.75 26.75,22.75 U$18.1
  Bottom 0.25: 22,22 22,22.25 U$18.P$1 22,22 | 22,22 22,17.75 U$18.2 | 22,22 17.75,22 U$18.4
BUS+3
  Top 0.25: 71.5,22.5 67.25,22.5 U$20.3 | 71.5,22.5 71.5,26.75 U$20.1 | 71.5,22.5 U$20.P$1
  Bottom 0.25: 72,22 72,22.25 U$20.P$1 72,22 | 72,22 72,17.75 U$20.4 | 72,22 76.25,22 U$20.2
BUS-  (via drill 0.5, 0.7)
  Top 0.25: U$4.2 63.5,67.75 63.5,63.5 U$4.P$1 | U$4.1 58.75,63 U$4.P$1 | U$4.3 63,58.75 63,63.25 U$4.P$1
  Top 0.8: FS8205A.23 v79.6,58.7 81.15,58.7 R20.2 | LAP4.C 31.35,18.18 | LED-G#2.C 31.35,18.18 | 31.35,18.18 31.35,19.55 38.8,27 v38.8,27.2 | v54.83,63.81 57.94,63.81 58.75,63
  Bottom 0.25: U$4.4 67.5,63.5 63.5,63.5 U$4.P$1
  Bottom 0.8: v79.6,58.7 72.78,58.7 U$4.4 | v38.8,27.2 38.8,28.8 40.5,30.5 55.75,30.5 64.27,39.02 64.45,39.02 65.03,39.59 65.03,44.49 63.9,45.62 63.9,53.18 54.83,62.25 v54.83,63.81
BUS-1
  Top 0.25: 30.5,63.5 26.25,63.5 U$2.2 | 30.5,63.5 30.5,67.75 U$2.4 | 30.5,63.5 U$2.P$1
  Bottom 0.25: 31,63 31,63.25 U$2.P$1 31,63 | 31,63 31,58.75 U$2.1 | 31,63 35.25,63 U$2.3
BUS-2
  Top 0.25: 30.5,30.5 30.5,26.25 U$19.2 | 30.5,30.5 26.25,30.5 U$19.4 | 30.5,30.5 U$19.P$1
  Bottom 0.25: 31.25,30.75 U$19.P$1 31.25,30.75 | 31.25,30.75 35,30.75 35.25,31 U$19.1 | 31.25,30.75 31.25,35.25 U$19.3
BUS-3
  Top 0.25: 63.5,30.5 63.5,26.25 U$21.4 | 63.5,30.5 67.75,30.5 U$21.2 | 63.5,30.5 U$21.P$1
  Bottom 0.25: 63,30.75 U$21.P$1 63,30.75 | 63,30.75 59,30.75 58.75,31 U$21.3 | 63,30.75 63,35.25 U$21.1
DS
  Top 0.3: U$13.12 55.71,68.35 61.74,68.35 64.92,71.53 64.92,81.53 74HC595#1.14
EN  (via drill 0.35)
  Top 0.25: v44.25,68.75 44.25,67 U$13.3 | v57.5,14.75 54.75,12 C7.1
  Top 0.3: R1.1 C7.1 55.6,11.85 USB-C.NRST/EN
  Bottom 0.25: v44.25,68.75 41.75,66.25 34.25,66.25 30.75,69.75 30.75,71.75 28.75,71.75 14.25,57.25 14.25,28 23,28 28.75,22.25 29.05,22.25 33.05,26.25 56.25,26.25 57.75,24.75 57.75,14.75 v57.5,14.75
GND  (via drill 0.35)
  Top 0.25: 74HC595#2.13 81.97,44.6 v81.3,44.6
  Top 0.3: 74HC595#3.13 33.98,12.43 v33.9,12.5 | v43.2,82.1 42.9,82.4 42.52,82.4 41.74,83.17 U$13.38 | U$13.15 59.72,70.25 60.4,70.25 62.34,72.2 v62.9,72.2
  Top 0.4: 48.6,16.83 48.6,17.5 LTC3633.10
  Top 0.5: C13.2 52.95,14.35 R9.2 50.51,14.44 C14.1 48.62,14.66 48.62,16.27 v48.6,16.3 48.6,16.83 | R8.2 40.95,14.35 C9.2 | C15.2 50.6,28.31 47,28.31 | C6.2 43.4,28.31 47,28.31 | v47,25.4 47,28.31
  Top 0.8: v27.2,12 v26,12
  Bottom 0.25: v81.3,44.6 80.81,44.6 80.81,43.8 79.19,43.8 79.19,44.6 v78.7,44.6
  Bottom 0.3: v33.9,12.5 35.9,14.5 v38.7,14.5 | BSK4.9 v43.19,82.11 v43.2,82.1 | v62.9,72.2 63.8,73.1 v65.9,73.1
  Bottom 0.5: 47.1,25.4 v47,25.4
  Bottom 0.6: v48.6,16.3 48.6,25.4 47.1,25.4
  Bottom 0.8: v27.2,12 v27.2,16 | v26,12 v26,16 | BSK2.1 v30.11,4.61 v30.1,4.6
  pour Top (isolate 0.3, no thermals): 6,80 9,80 10,79 12,79 15,82 15,88 27,88 27,94 67,94 67,88 78,88 79,88 79,82 82,79 84,79 85,80 88,80 88,67 94,67 94,27 88,27 88,15 88,14 85,14 84,15 82,15 79,12 79,6 67,6 67,0 27,0 27,6 15,6 15,12 12,15 10,15 9,14 6,14 6,27 0,27 0,67 6,67
  cutout Top: 22.25,65.25 24.25,63.25 30.75,69.75 28.75,71.75
HEAT1
  cutout Top: 63.25,24.25 65.25,22.25 71.75,28.75 69.75,30.75
HEAT2
  cutout Top: 69.7,63.3 71.7,65.3 65.3,71.7 63.3,69.7
HEAT3
  cutout Top: 28.75,22.25 30.75,24.25 24.25,30.75 22.25,28.75
I2CINT
  Top 0.3: U$13.29 53.17,86.6 BSK4.5
IO0  (via drill 0.35)
  Top 0.3: U$13.25 58.25,82.65 54.5,82.65 v54.5,82.3 | USB-C.NC/GPIO 60.4,11.51 v61,11.51 61.59,12.1 v62.7,12.1 | R2.1 50.26,11.81 v49.1,11.81
  Bottom 0.3: v61,11.51 60.7,11.81 v49.1,11.81 | v62.7,12.1 63.24,12.64 74.26,12.64 82.12,20.5 82.12,33.01 75.17,39.96 75.17,45.21 75.06,45.32 67.05,45.32 65.72,46.65 65.72,53.85 56.8,62.77 56.8,66.81 52.51,71.1 48.6,71.1 47.5,72.2 47.5,80.7 49.1,82.3 v54.5,82.3
IO1
  Top 0.3: R3.1 61.2,82.15 55.33,82.15 55.33,81.47 51.9,81.47 U$13.30
MTCK  (via drill 0.35)
  Top 0.25: v43.75,71.25 59.25,71.25 U$13.16
  Bottom 0.25: v43.75,71.25 43.75,81.25 43,81.25 41.75,82.5 41.75,85.25 29.25,85.25 8.8,64.8
  Bottom 0.3: 8.8,64.8 8.8,53.47 8.53,53.2 8.53,39.78 JTAG.5
MTDI  (via drill 0.35)
  Top 0.25: v59.5,67 U$13.14 | v48.25,77.75 45.5,77.75 v41.25,82 | v23.25,78.25 23.1,78.4 v21.2,78.4
  Top 0.3: v8.7,65.8 8.5,65.6 8.5,62.81 v9.85,61.46
  Bottom 0.25: v59.5,67 57.5,69 56.5,69 48.25,77.25 v48.25,77.75 | v41.25,82 41.25,84.75 29.75,84.75 v23.25,78.25
  Bottom 0.3: v8.7,65.8 21.2,78.3 v21.2,78.4 | v9.85,61.46 9.85,41 JTAG.6
MTDO  (via drill 0.35)
  Top 0.25: v57.5,80 59.25,80 U$13.23
  Top 0.3: v15.5,57 v13.5,55
  Bottom 0.25: v57.5,80 57.5,83.1 50.15,83.1 47,86.25 47,87.75 45.25,87.75 44.5,87 44.5,69.5 44.75,69.25 44.75,69.24 44.95,69.04 44.95,65.35 42.88,63.27 39.98,63.27 33.7,57 v15.5,57
  Bottom 0.3: v13.5,55 13.5,35.53 JTAG.3
MTMS  (via drill 0.35)
  Top 0.25: 56.25,65.5 56.75,66 56.75,67 U$13.13 | v30.25,56.25 25.5,61 v17,61
  Top 0.3: 56.25,65.5 56.17,65.42 v55.07,65.42
  Bottom 0.25: 40.2,62.8 33.65,56.25 v30.25,56.25 | v17,61 12.25,56.25
  Bottom 0.3: v55.07,65.42 55.07,65.4 52.48,62.8 40.2,62.8 | 12.25,56.25 12.25,36.82 JTAG.4
N$1  (via drill 0.35)
  Top 0.3: L293DD.3 74.81,49.88 v74.8,49.9 | v64.8,57 67.61,57 EM.1 68.74,57.02 71.52,59.8 75.73,59.8 78.28,57.25 LED-R#1.C LED-B#1.A
  Bottom 0.3: v74.8,49.9 74.8,55.66 73.03,57.43 65.23,57.43 v64.8,57
N$2  (via drill 0.35)
  Top 0.3: L293DD.8 v68.47,50.7 68.47,52.19 EM.2 | R81.1 R4.1 v79.4,50.4
  Bottom 0.3: v79.4,50.4 76.33,50.4 75.1,49.17 74.5,49.17 72.97,50.7 v68.47,50.7
N$3  (via drill 0.35)
  Top 0.25: 74,40 74.75,39.25 74.75,38.5 L293DD.18 | v26.75,56.25 25.25,57.75 HEATER.1
  Top 0.3: LED-B#2.A 15.75,57.8 15.75,59.09 16.79,60.13 22.76,60.13 HEATER.1 | 74,40 73.9,40.1 v73.4,40.1 | v64.05,40 66.06,40 v66.1,40.04
  Bottom 0.25: v64.05,40 63.35,40 54.6,31.25 40.5,31.25 26.75,45 v26.75,56.25
  Bottom 0.3: v73.4,40.1 66.16,40.1 v66.1,40.04
N$4  (via drill 1)
  other vias: 7.1,7.1
N$5  (via drill 1)
  other vias: 12.9,7.1
N$6  (via drill 1)
  other vias: 86.9,7.1
N$7  (via drill 1)
  other vias: 86.9,12.9
N$8
  Top 0.25: FS8205A.4 81.95,61.17 R10.2
N$9
  Top 0.25: FS8205A.5 81.95,64.42 R11.2
N$10  (via drill 1)
  other vias: 7.1,12.9
N$11  (via drill 1)
  other vias: 11.1,13.95
N$12  (via drill 1)
  other vias: 13.95,11.1
N$13  (via drill 1)
  other vias: 81.1,7.1
N$14  (via drill 1)
  other vias: 80.05,11.1
N$15  (via drill 1)
  other vias: 82.9,13.95
N$16  (via drill 1)
  other vias: 86.9,86.9
N$17  (via drill 1)
  other vias: 81.1,86.9
N$18  (via drill 1)
  other vias: 86.9,81.1
N$19  (via drill 0.35)
  Top 0.25: 74HC595#1.9 66.97,84.78 v67.4,85.2 | v81.9,47.5 81.33,47.5 74HC595#2.14
  Bottom 0.25: v67.4,85.2 67.7,85.5 76.87,85.5 76.87,80 80,76.87 85.41,76.87 85.41,47.5 v81.9,47.5
N$20  (via drill 0.35)
  Top 0.25: v82.7,36.2 79.5,39.41 79.5,40.2
  Top 0.3: 79.5,40.2 79.5,42.21 79.81,42.53 82.91,42.53 84.58,44.19 74HC595#2.9 | v36.8,13.38 36.8,13.07 74HC595#3.14
  Bottom 0.3: v36.8,13.38 37.64,12.54 61,12.54 62.26,11.28 73.84,11.28 82.7,20.13 v82.7,36.2
N$21  (via drill 1)
  other vias: 82.9,80.05
N$22  (via drill 1)
  other vias: 80.05,82.9
N$23  (via drill 1)
  other vias: 7.1,86.9
N$24  (via drill 0.35)
  Top 0.3: 45.47,18.42 46.45,18.42 46.67,18.19 LTC3633.7 LTC3633.8 47.33,18.21 47.55,18.43 50.98,18.43 51.23,18.19 LTC3633.14 | 45.47,18.42 42.95,18.42 42.76,18.23 42.76,17.54 LTC3633.1 | 45.47,18.42 45.38,18.33 LTC3633.5 45.38,14.67 C14.2 46.18,14.67 v47.11,15.6 | LTC3633.21 47.33,23.98 v47,24.3 46.67,23.98 LTC3633.22
  Bottom 0.3: v47,24.3 47.11,24.19
  Bottom 0.6: 47.11,24.19 v47.11,15.6
N$25  (via drill 0.35)
  Top 0.3: v38.4,16.9 38.4,16.5 39.2,15.7 43.05,15.7 R8.1 43.4,16.09 44.08,16.77 LTC3633.3 | v38,22.8 R13.1
  Bottom 0.3: v38.4,16.9 38,17.3 v38,22.8
N$26  (via drill 1)
  other vias: 7.1,81.1
N$27  (via drill 1)
  other vias: 12.9,86.9
N$28
  Top 0.3: LTC3633.26 44.08,23.77 B82498F#1.1 43.73,24.8 44.6,25.68 44.6,26.25 C5.1
N$29  (via drill 1)
  other vias: 13.95,82.9
N$30  (via drill 1)
  other vias: 11.1,80.05
N$31
  Top 0.3: LTC3633.23 46.02,23.62 46.14,23.74 46.14,25.01 C5.2
N$32
  Top 0.3: LTC3633.20 47.98,25.12 C1.1
N$33
  Top 0.3: C1.2 49.4,26.25 49.4,25.68 50.27,24.8 B82498F#2.1 50.58,24.43 LTC3633.16
N$34
  Top 0.3: LED-B#3.C R3.2
N$35
  Top 0.3: LED-B#1.C R81.2
N$36
  Top 0.3: LED-R#1.A R4.2
N$37
  Top 0.3: R5.1 18.5,58.55 LED-B#2.C
N$38  (via drill 0.35)
  Top 0.3: R6.2 34.15,16.1 LED-G#2.A 32.85,16.95 v32.5,17.3 | v34.2,25.4 34.3,25.3 LAP4.A
  Bottom 0.3: v32.5,17.3 32.8,17.6 32.8,22.95 34.5,24.65 34.5,25.1 v34.2,25.4
N$39  (via drill 0.35)
  Top 0.3: LTC3633.12 49.92,16.73 R9.1 50.94,15.71 54.73,15.71 55.72,16.7 v55.72,16.9 | v55.9,22.8 R12.1
  Bottom 0.3: v55.9,22.8 55.72,22.62 v55.72,16.9
PL_KVCC  (via drill 0.35)
  Top 0.3: U$13.9 v51.9,68.9
  Bottom 0.3: v51.9,68.9 45.73,68.9 BSK4.8
RX-C  (via drill 0.35)
  Top 0.3: USB-C.SWD/RXD 57.75,13.11 v57.38,13.47 | v47.5,82.2 46.82,82.88 U$13.34
  Bottom 0.3: v57.38,13.47 57.72,13.14 74.05,13.14 81.53,20.62 81.53,32.89 74.67,39.75 74.67,44.8 66.55,44.8 65.22,46.13 65.22,53.64 56.3,62.56 56.3,66.61 52.31,70.6 48.2,70.6 47,71.8 47,81.07 47.23,81.3 47.23,81.93 v47.5,82.2
SCLTM  (via drill 0.35)
  Top 0.25: v61.2,74.9 61.2,76.45 R7.2
  Top 0.3: BSK4.7 48.27,88.91 57.1,88.91 57.1,85.39 55.71,85.39 U$13.27
  Bottom 0.25: BSK4.7 50.77,84.1 57.8,84.1 61.2,80.7 v61.2,74.9
SDATM  (via drill 0.35)
  Top 0.25: v62,80.3 62,79.45 R14.2
  Top 0.3: U$13.28 54.44,85.39 54.56,85.39 54.56,87.81 50.81,87.81 BSK4.6
  Bottom 0.25: BSK4.6 52.31,85.1 58.4,85.1 62,81.5 v62,80.3
SHCP  (via drill 0.35)
  Top 0.25: 74HC595#1.11 67.4,83.47 v67.4,83.9 | v83.6,48.3 83.28,48.3 74HC595#2.11 83.28,45.27 82.9,44.89 82.9,43.2 82.7,43.01 79.62,43.01 79.02,42.41 79.02,38.78 v84.6,33.2 | v42.5,10.1 41.95,10.65 41.95,10.66 41.49,11.12 74HC595#3.11
  Top 0.3: v61.2,69.8 61.77,69.8 63.92,71.94 63.92,82.21 65.19,83.47 74HC595#1.11 | v56.7,69.8 55.3,69.8 53.17,67.67 U$13.10
  Bottom 0.25: v67.4,83.9 68.55,85.05 76.42,85.05 76.42,79.55 79.55,76.42 84.9,76.42 84.9,48.3 v83.6,48.3 | v84.6,33.2 84.6,20.73 73.97,10.1 v42.5,10.1
  Bottom 0.3: v61.2,69.8 v56.7,69.8
STCP  (via drill 0.35)
  Top 0.25: v82.6,49 82.62,49 74HC595#2.12 82.62,45.26 82.45,45.08 82.45,43.45 79.43,43.45 78.57,42.59 78.57,38.13 v83.5,33.2 | v67.4,82.75 67.32,82.83 74HC595#1.12 | 74HC595#3.12 42.43,11.78 v43.4,10.8
  Top 0.3: U$13.11 54.44,67.79 55.5,68.85 61.53,68.85 64.42,71.74 64.42,82 65.25,82.83 74HC595#1.12
  Bottom 0.25: v67.4,82.75 69.25,84.6 75.97,84.6 75.97,79.1 79.1,75.97 84.45,75.97 84.45,49.3 82.91,49.3 v82.6,49 | v83.5,33.2 83.5,20.26 74.04,10.8 v43.4,10.8
TIME
  Top 0.3: BSK4.4 55.89,88.41 49.6,88.41 49.6,85.39 50.63,85.39 U$13.31
TX-C  (via drill 0.35)
  Top 0.3: USB-C.SWC/TXD 58.25,13.58 v58.54,13.87 | v46.5,81.6 45.55,82.55 U$13.35
  Bottom 0.3: v46.5,81.6 46.5,71.5 47.9,70.1 52.1,70.1 55.8,66.4 55.8,62.34 64.65,53.49 64.65,45.93 66.28,44.3 74.13,44.3 74.13,39.59 80.98,32.74 80.98,20.84 73.94,13.8 58.61,13.8 v58.54,13.87
VDD  (via drill 0.35, 0.5)
  Top 0.25: 74HC595#3.16 32.6,14.38 v32.6,14.43 | 74HC595#2.10 83.92,44.6 v83.6,44.6 | 74HC595#2.16 80.03,44.62 v80,44.6 | 86,68.25 86,68.75 82.62,72.12 | U$13.2 v43.01,65.31 v43,65.3
  Top 0.3: v62.4,88.7 63.51,87.59 BSK4.1 63.51,84.36 LED-B#3.A 63.27,84.12 74HC595#1.10 | v64.3,91.27 64.3,93.52 27.48,93.52 27.48,87.52 17.3,87.52 | 17.3,87.52 15.15,87.52 15.15,81.7 12.3,78.85 6.5,78.85 6.5,66.52 0.48,66.52 0.48,30.1 | 0.48,30.1 0.48,27.48 6.48,27.48 6.48,15.15 12.3,15.15 15.15,12.3 15.15,6.48 27.48,6.48 27.48,5.7 27.58,5.6 41.5,5.6 | 41.5,5.6 41.5,9.8 40.83,10.47 74HC595#3.10 34.62,10.47 v34,11.1 | v65.9,79.3 74HC595#1.16 | v39.6,24.8 B82498F#1.2 | R1.2 R2.2 50.3,5.6 41.5,5.6 | v90.2,50 90.2,56.9 v90.1,57 | 86,68.25 86,64.4 v86.2,64.2 | 82.62,72.12 78.78,72.12 v78.5,72.4 | v26.2,79.8 v24.3,81.7 | v17.38,85.3 17.3,85.38 17.3,87.52 | v26.2,79.8 C3.1 32.75,73.95 C33.1 32.75,68.95 v33.1,68.6 33.1,67.2 34.75,65.55 v35.22,65.55 | v26.2,79.8 | v2.3,30.1 0.48,30.1 | v63.1,80.3 63.1,78.85 R14.1 R7.1
  Top 0.4: LTC3633.28 40.92,23.07
  Top 0.5: 40.92,23.07 R13.2 B82498F#1.2 40.95,26.55 C6.1
  Bottom 0.25: v80,44.6 80,46.2 83.6,46.2 v83.6,44.6 81,42 81,41 85.25,41 | 90.2,45.95 v90.2,50 | v43,65.3 42.75,65.55 v35.22,65.55
  Bottom 0.3: v62.4,88.7 64.3,90.6 v64.3,91.27 64.3,80.9 | 64.3,80.9 v65.9,79.3 71.6,79.3 v78.5,72.4 | v39.6,24.8 37.1,24.8 37.1,18.93 v32.6,14.43 32.6,12.5 v34,11.1 | 85.25,41 85.26,41 86.34,42.08 87.06,42.08 90.2,45.22 90.2,45.95 | v90.1,57 90.1,60.3 v86.2,64.2 | v33.1,68.6 31.23,70.47 31.23,71.95 26.2,76.97 v26.2,79.8 | v24.3,81.7 20.7,85.3 v17.38,85.3 | JTAG.2 v2.31,30.09 v2.3,30.1 | 64.3,80.9 63.69,80.3 v63.1,80.3

### Text on the board
tPlace: SDATM | SCLTM
tNames: HEATER | EM- | EM+ | MTDI | MTCK | MTMS | MTDO | VDD | BUS
bNames: to BSK4 | BSK1 / "Концерн ИТС" | BUS+ | BUS+ | to BSK2A | BUS- | BUS- | to BSK3 | BUS- | BUS- | BUS+ | BUS+ | to BSK2